# EAGLE design main (EAGLE 7.7.0)
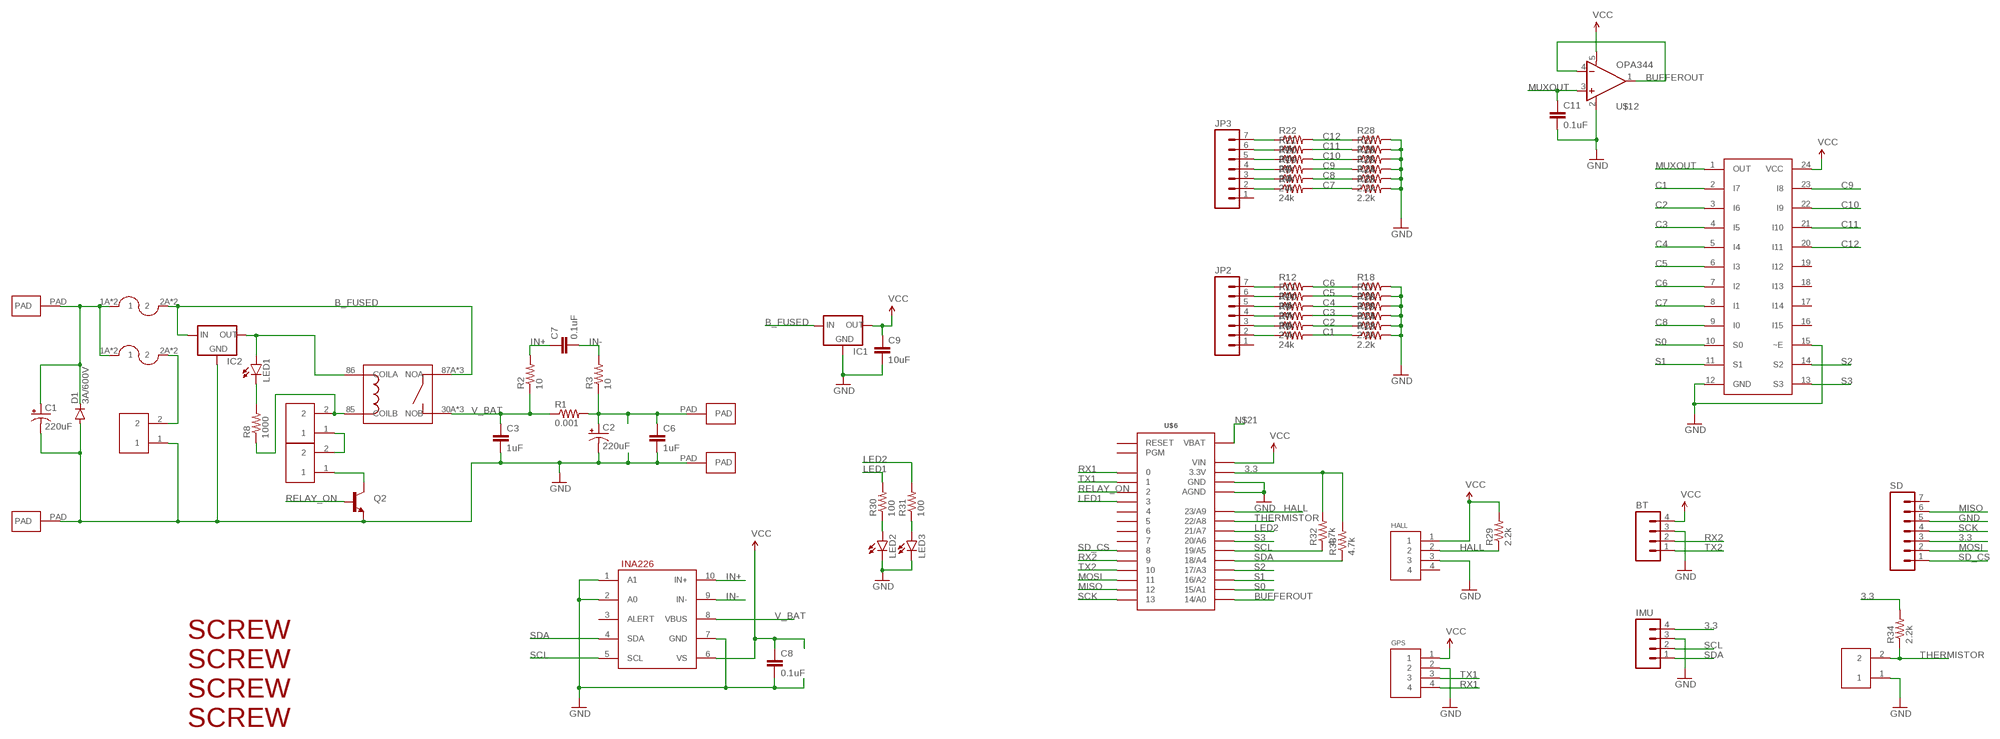
[diagram p0: schematic, sheet 1]

## Parts
BT  M04PTH  [1X04]
C1  220uF  CAP_POLPTH4  [CPOL-RADIAL-1000UF-25V]
C2  220uF  CAP_POLPTH4  [CPOL-RADIAL-1000UF-25V]
C3  1uF  CAP1206  [1206]
C6  1uF  CAP1206  [1206]
C7  0.1uF  CAP0603-CAP  [0603-CAP]
C8  0.1uF  CAP0603-CAP  [0603-CAP]
C9  10uF  CAP0805  [0805]
C11  0.1uF  CAP0603-CAP  [0603-CAP]
D1  3A/600V  DIODEES3J  [SMC]
GPS  GPS  HEADER4VALULOK  [4PINVALULOK]
HALL  HEADER4VALULOK  [4PINVALULOK]
IC1  V_REG_78XXSINK  [TO220-IGO]
IC2  V_REG_78XXSINK  [TO220-IGO]
IMU  M04PTH  [1X04]
JP2  M07  [1X07]
JP3  M07  [1X07]
LED1  LED1206  [LED-1206]
LED2  LED1206  [LED-1206]
LED3  LED1206  [LED-1206]
Q2  TRANSISTOR_NPNSMD2  [SOT223]
R1  0.001  RESISTOR2512  [R2512]
R2  10  RESISTOR0603-RES  [0603-RES]
R3  10  RESISTOR0603-RES  [0603-RES]
R4  24k  RESISTOR0603-RES  [0603-RES]
R5  24k  RESISTOR0603-RES  [0603-RES]
R6  24k  RESISTOR0603-RES  [0603-RES]
R7  24k  RESISTOR0603-RES  [0603-RES]
R8  1000  RESISTOR0603-RES  [0603-RES]
R9  24k  RESISTOR0603-RES  [0603-RES]
R10  24k  RESISTOR0603-RES  [0603-RES]
R11  24k  RESISTOR0603-RES  [0603-RES]
R12  24k  RESISTOR0603-RES  [0603-RES]
R13  2.2k  RESISTOR0603-RES  [0603-RES]
R14  2.2k  RESISTOR0603-RES  [0603-RES]
R15  2.2k  RESISTOR0603-RES  [0603-RES]
R16  2.2k  RESISTOR0603-RES  [0603-RES]
R17  2.2k  RESISTOR0603-RES  [0603-RES]
R18  2.2k  RESISTOR0603-RES  [0603-RES]
R19  24k  RESISTOR0603-RES  [0603-RES]
R20  24k  RESISTOR0603-RES  [0603-RES]
R21  24k  RESISTOR0603-RES  [0603-RES]
R22  24k  RESISTOR0603-RES  [0603-RES]
R23  2.2k  RESISTOR0603-RES  [0603-RES]
R24  2.2k  RESISTOR0603-RES  [0603-RES]
R25  2.2k  RESISTOR0603-RES  [0603-RES]
R26  2.2k  RESISTOR0603-RES  [0603-RES]
R27  2.2k  RESISTOR0603-RES  [0603-RES]
R28  2.2k  RESISTOR0603-RES  [0603-RES]
R29  2.2k  RESISTOR0603-RES  [0603-RES]
R30  100  RESISTOR0603-RES  [0603-RES]
R31  100  RESISTOR0603-RES  [0603-RES]
R32  4.7k  RESISTOR0603-RES  [0603-RES]
R33  4.7k  RESISTOR0603-RES  [0603-RES]
R34  2.2k  RESISTOR0603-RES  [0603-RES]
SD  M07  [1X07]
U$1  INA226  [PSOP-10]
U$2  PAD  [PAD]
U$3  PAD  [PAD]
U$4  PAD  [PAD]
U$5  PAD  [PAD]
U$6  TEENSY_3.0_BASIC  [TEENSY_3.0_BASIC]
U$7  RELAY  [PANASONIC_HP_RELAY]
U$8  FUSE  [AUTO_FUSE]
U$9  HEADER2  [2PINVALULOK]
U$10  HEADER2  [2PINVALULOK]
U$11  CD74HC4067  [SO-24DW]
U$12  OPA344  [SOT23-5]
U$13  SCREW  [M3HOLE]
U$14  SCREW  [M3HOLE]
U$15  SCREW  [M3HOLE]
U$16  SCREW  [M3HOLE]
U$17  HEADER2  [2PINVALULOK]
U$18  FUSE  [AUTO_FUSE]
U$19  HEADER2  [2PINVALULOK]

## Nets
3.3: IMU.4 R32.2 R33.2 R34.2 SD.3 U$6.3.3V U$6.3.3V1(3.3V)
B_FUSED: IC1.IN IC2.IN U$7.87A(NOA) U$7.87B(NOA) U$7.87C(NOA) U$8.2A U$8.2B
B_OUT: C2.+ C6.1 R1.2 R3.1 U$4.PAD
B_RAW: C1.+ D1.C U$2.PAD U$8.1A U$8.1B U$18.1A U$18.1B
BUFFEROUT: U$6.14/A0 U$12.1(OUT) U$12.4(-IN)
C1: R6.2 R13.1 U$11.2(I7)
C2: R7.2 R14.1 U$11.3(I6)
C3: R9.2 R15.1 U$11.4(I5)
C4: R10.2 R16.1 U$11.5(I4)
C5: R11.2 R17.1 U$11.6(I3)
C6: R12.2 R18.1 U$11.7(I2)
C7: R4.2 R23.1 U$11.8(I1)
C8: R5.2 R24.1 U$11.9(I0)
C9: R19.2 R25.1 U$11.23(I8)
C10: R20.2 R26.1 U$11.22(I9)
C11: R21.2 R27.1 U$11.21(I10)
C12: R22.2 R28.1 U$11.20(I11)
GND: BT.3 C1.- C2.- C3.2 C6.2 C8.2 C9.2 C11.2 D1.A GPS.2 HALL.3 IC1.GND IC2.GND IMU.3 LED2.C LED3.C Q2.3(E) R13.2 R14.2 R15.2 R16.2 R17.2 R18.2 R23.2 R24.2 R25.2 R26.2 R27.2 R28.2 SD.5 U$1.1(A1) U$1.2(A0) U$1.7(GND) U$3.PAD U$5.PAD U$6.AGND U$6.GND U$6.GND1(GND) U$11.12(GND) U$11.15(~E) U$12.2(V-) U$17.1 U$19.1
HALL: HALL.2 R29.1 U$6.23/A9
IN+: C7.1 R2.2 U$1.10(IN+)
IN-: C7.2 R3.2 U$1.9(IN-)
LED1: R30.2 U$6.3
LED2: R31.2 U$6.21/A7
MISO: SD.6 U$6.12
MOSI: SD.2 U$6.11
MUXOUT: C11.1 U$11.1(OUT) U$12.3(+IN)
N$1: JP2.7 R12.1
N$2: LED2.A R30.1
N$3: JP2.6 R11.1
N$4: JP2.5 R10.1
N$5: U$18.2A U$18.2B U$19.2
N$6: JP2.4 R9.1
N$7: IC2.OUT LED1.A U$7.86(COILA)
N$8: JP2.3 R7.1
N$9: LED1.C R8.2
N$10: R8.1 U$7.85(COILB) U$9.2
N$11: JP2.2 R6.1
N$12: U$9.1 U$10.2
N$13: Q2.2(C) U$10.1
N$14: JP3.7 R22.1
N$15: JP3.6 R21.1
N$16: JP3.5 R20.1
N$17: JP3.4 R19.1
N$18: JP3.3 R5.1
N$19: JP3.2 R4.1
N$20: LED3.A R31.1
N$21: U$6.VBAT
RELAY_ON: Q2.1(B) U$6.2
RX1: GPS.4 U$6.0
RX2: BT.2 U$6.9
S0: U$6.15/A1 U$11.10(S0)
S1: U$6.16/A2 U$11.11(S1)
S2: U$6.17/A3 U$11.14(S2)
S3: U$6.20/A6 U$11.13(S3)
SCK: SD.4 U$6.13
SCL: IMU.2 R32.1 U$1.5(SCL) U$6.19/A5
SD_CS: SD.1 U$6.8
SDA: IMU.1 R33.1 U$1.4(SDA) U$6.18/A4
THERMISTOR: R34.1 U$6.22/A8 U$17.2
TX1: GPS.3 U$6.1
TX2: BT.1 U$6.10
V_BAT: C3.1 R1.1 R2.1 U$1.8(VBUS) U$7.30A(NOB) U$7.30B(NOB) U$7.30C(NOB)
VCC: BT.4 C8.1 C9.1 GPS.1 HALL.1 IC1.OUT R29.2 U$1.6(VS) U$6.VIN U$11.24(VCC) U$12.5(V+)
Unconnected: HALL.4 JP2.1 JP3.1 SD.7 U$1.3(ALERT) U$6.4 U$6.5 U$6.6 U$6.7 U$6.PGM U$6.RESET U$11.16(I15) U$11.17(I14) U$11.18(I13) U$11.19(I12)

## Library data of the parts
BT IMU = SparkFun-Connectors:M04: Header 4 Standard 4-pin 0.1" header. Use with straight break away headers (SKU : PRT-00116), right angle break away headers (PRT-00553), swiss pins (PRT-00743), machine pins (PRT-00117), and female headers (PRT-00115). Molex polarized connector foot print use with SKU : PRT-08231 with associated crimp pins and housings. 1MM SMD Version SKU: PRT-10208
C1 C2 = SparkFun-Capacitors:CAP_POL: Capacitor Polarized These are standard SMD and PTH capacitors. Normally 10uF, 47uF, and 100uF in electrolytic and tantalum varieties. Always verify the external diameter of the through hole cap, it varies with capacity, voltage, and manufacturer. The EIA devices should be standard.
C3 C6 = SparkFun-Capacitors:CAP: Capacitor Standard 0603 ceramic capacitor, and 0.1" leaded capacitor.
C7-C9 C11 = SparkFun-Passives:CAP: Capacitor Standard 0603 ceramic capacitor, and 0.1" leaded capacitor.
D1 = SparkFun-DiscreteSemi:DIODE: Diode These are standard reverse protection diodes and small signal diodes. SMA package can handle up to about 1A. SOD-323 can handle about 200mA. What the SOD-323 package when ordering, there are some mfgs out there that are 5-pin packages.; PROD_ID: DIO-12441
GPS HALL = Custom_old:HEADER4
IC1 IC2 = SparkFun-PowerIC:V_REG_78XX: Voltage Regulator Standard 7805 5V regulator. IGO (Input Ground Output). Spark Fun Electronics SKU : COM-00107
JP2 JP3 SD = SparkFun-Connectors:M07: Header 7 Standard 7-pin 0.1" header. Use with straight break away headers (SKU : PRT-00116), right angle break away headers (PRT-00553), swiss pins (PRT-00743), machine pins (PRT-00117), and female headers (PRT-00115). NOTES ON THE VARIANTS LOCK and LOCK_LONGPADS... This footprint was designed to help hold the alignment of a through-hole component (i.e. 7-pin header) while soldering it into place. You may notice that each hole has been shifted either up or down by 0.005 of an inch from it's more standard position (which is usually a perfectly straight line). This slight alteration caused the pins (the squares in the middle) to touch the edges of the holes. Because they are alternating, it causes a "brace" to hold the header in place. 0.005 has proven to be the perfect amount of "off-center" position when using our standard breakaway headers. Although looks a little odd when you look at the bare footprint, once you have a header in there, the alteration is very hard to notice. Also, if you push a header all the way into place, it is covered up entirely on the bottom side. This idea of altering the position of holes to aid alignment will be further integrated into the Sparkfun Library for other footprints. It can help hold any component with 3 or more connection pins.
LED1-LED3 = SparkFun-LED:LED: LEDs Standard schematic elements and footprints for 5mm, 3mm, 1206, and 0603 sized LEDs. 5mm - Spark Fun Electronics SKU : COM-00529 (and others)
Q2 = SparkFun-DiscreteSemi:TRANSISTOR_NPN: Generic NPN BJT MMBT2222A - TRANS-08049 (SOT-23, 1A 40V) MPSA42 - TRANS-09116 (SOT-23, 500mA 300V) MMBT5088LT1G - TRANS-11160 (SOT-23, 50 mA 30V) BC547 - COM-08928 <http://www.sparkfun.com/products/8928> (TO-92 45V 100mA) (1.Collector 2.Base 3.Emitter) 2N3904 - COM-00521 <http://www.sparkfun.com/products/521> (TO-92 40V 200mA) (1.Emitter 2.Base 3.Collector) P2N2222A - COM-12852 <http://www.sparkfun.com/products/12852> (TO-92 40V 600mA) (1.Collector 2.Base 3.Emitter)
R1 = SparkFun-Resistors:RESISTOR: Resistor Basic schematic elements and footprints for 0603, 1206, and PTH resistors.
R2-R34 = SparkFun-Passives:RESISTOR: Resistor Basic schematic elements and footprints for 0603, 1206, and PTH resistors.
U$1 = Custom_old:INA226
U$2-U$5 = Custom_old:PAD
U$6 = Teensy3.0:TEENSY_3.0_BASIC: Basic Teensy 3.0 with none of the 'inner' pins enabled. See '+4', 'AllAnalogPins", and 'AllPins' packages for additional pin holes, as needed.
U$7 = Custom_old:RELAY
U$8 U$18 = Custom_old:FUSE
U$9 U$10 U$17 U$19 = Custom_old:HEADER2
U$11 = Custom_old:CD74HC4067
U$12 = SparkFun-AnalogIC:OPA344: Single gate rail-to-rail output op-amp. Inputs extend 300mV past rails.
U$13-U$16 = Custom_old:SCREW

## Board
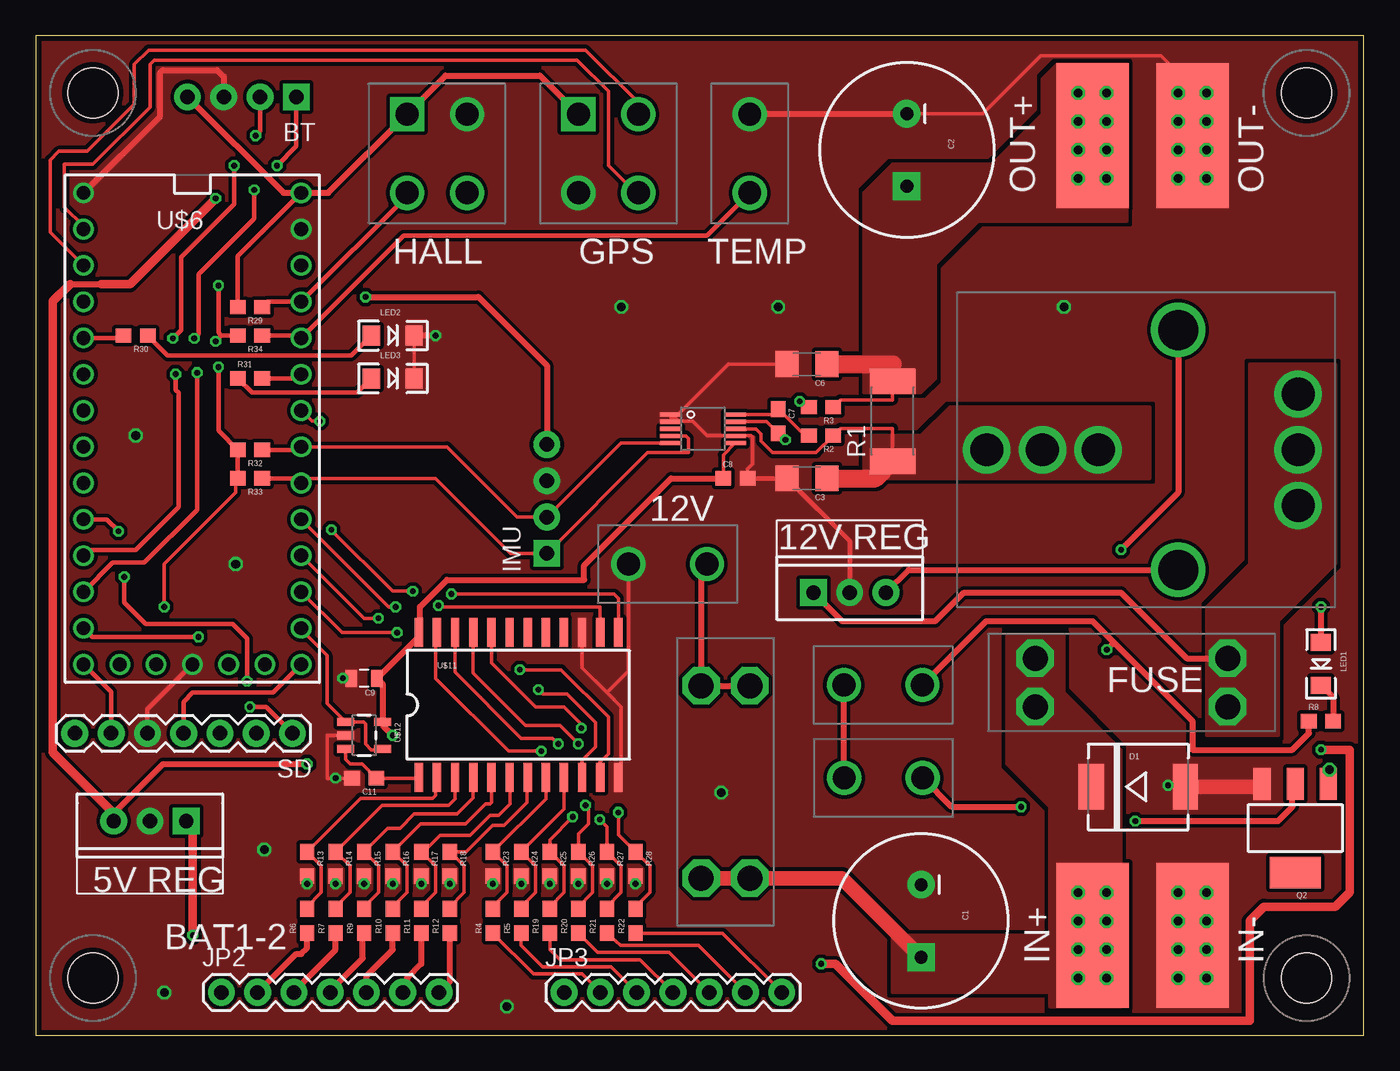
[diagram p1: board, top side]
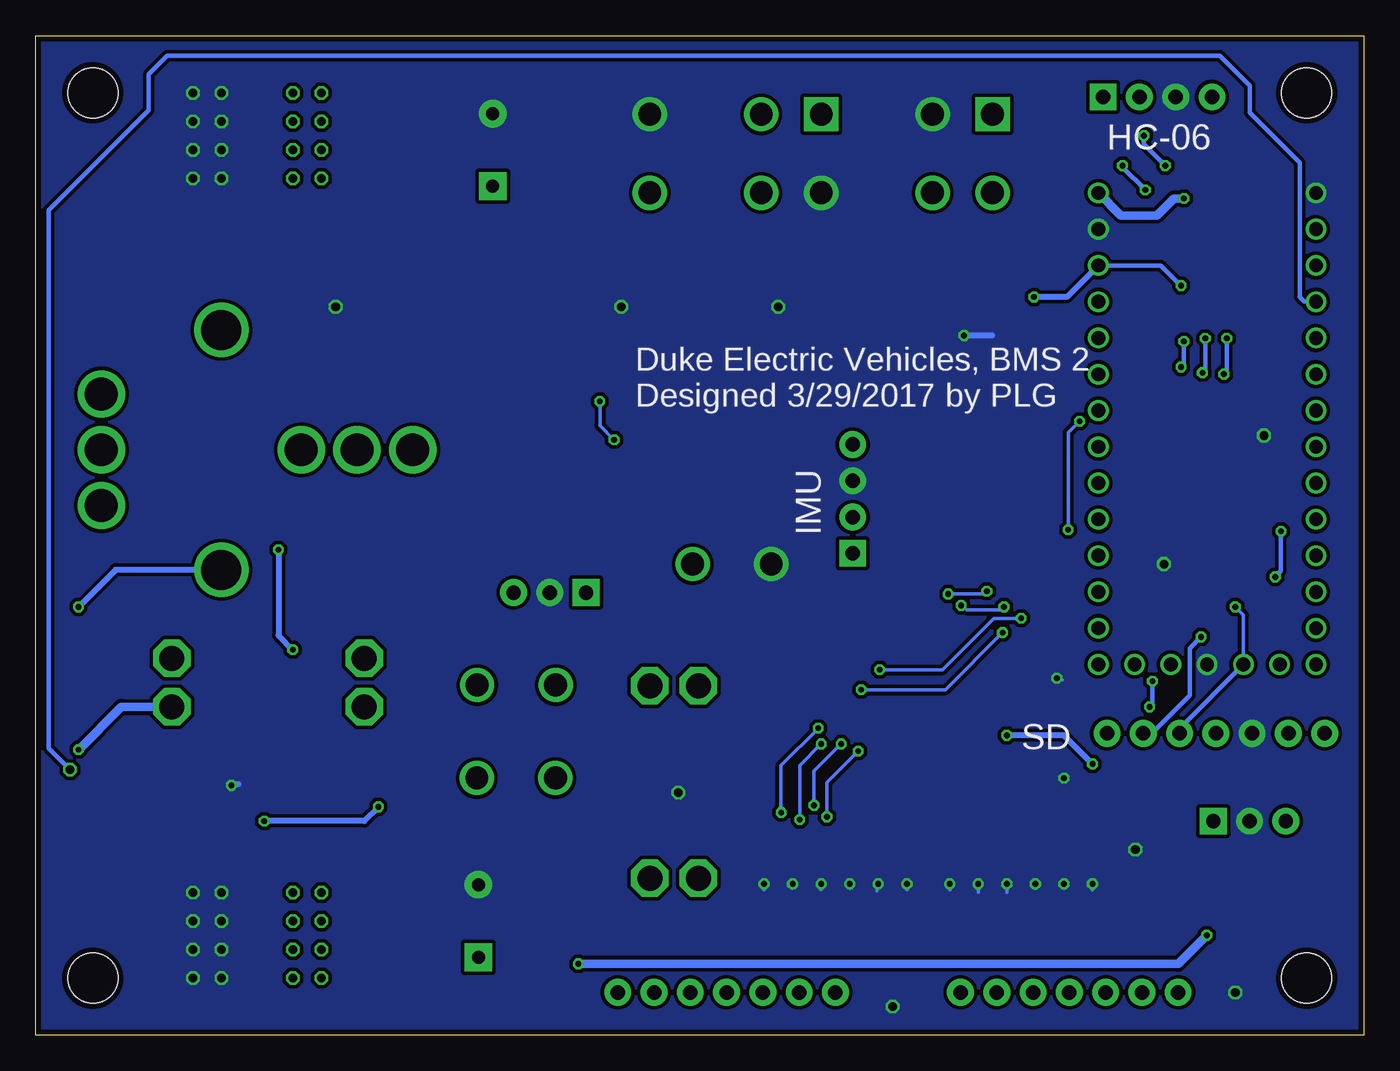
[diagram p2: board, bottom side, seen from below]

Size 93 x 70 mm. Coordinates in mm from the lower left corner, seen from the top.
Outline: 0,0 93,0 93,70 0,70 0,0
Copper layers (1*16): Top 0.0356mm / dielectric 1.5011mm / Bottom 0.0356mm
Design rules "PatrickOSHPARK *": minimum track width 6mil, minimum drill 13mil, track to track 6mil, track to pad 6mil, pad to pad 6mil, via to via 6mil, smd to smd 6mil, copper to edge 15mil, drill to drill 6mil, minimum pad ring 7mil, minimum via ring 7mil, stop-mask expansion 3mil, vias tented up to drill 20mil, thermal gap 10mil

### Footprints (pad centres in the part's own frame; a part is rotated, then mirrored left to right if it is on the bottom)
1X04 = drill 1.016 pad 1.88 square: 1 0,0 | drill 1.016 pad 1.88: 2 2.54,0; 3 5.08,0; 4 7.62,0
CPOL-RADIAL-1000UF-25V = drill 0.9 pad 1.93 square: + 2.54,0 | drill 0.9 pad 1.93: - -2.54,0
1206 = smd 1.6 x 1.8: 1 -1.4,0; 2 1.4,0
0603-CAP = smd 1.1 x 1: 1 -0.85,0; 2 0.85,0
0805 = smd 0.8 x 1.2: 1 -0.9,0; 2 0.9,0
SMC = smd 1.778 x 3.175: A 3.302,0; C -3.302,0
4PINVALULOK = drill 1.6 square: 1 0,5.5 | drill 1.6: 2 0,0; 3 4.2,5.5; 4 4.2,0
TO220-IGO = drill 1 pad 1.88: GND 0,0; OUT 2.54,0 | drill 1 pad 1.88 square: IN -2.54,0
1X07 = drill 1.016 pad 1.88: 1 0,0; 2 2.54,0; 3 5.08,0; 4 7.62,0; 5 10.16,0; 6 12.7,0; 7 15.24,0
LED-1206 = smd 1.2 x 1.4: A -1.5,0; C 1.5,0
SOT223 = smd 1.219 x 2.235: 1 -2.311,-3.099; 2 0,-3.099; 3 2.311,-3.099 | smd 3.6 x 2.2: 4 0,3.099
R2512 = smd 1.8 x 3.2: 1 -2.8,0; 2 2.8,0
0603-RES = smd 1.1 x 1: 1 -0.85,0; 2 0.85,0
PSOP-10 = smd 1.5 x 0.3: 1 0,1; 2 0,0.5; 3 0,0; 4 0,-0.5; 5 0,-1; 6 4.5,-1; 7 4.5,-0.5; 8 4.5,0; 9 4.5,0.5; 10 4.5,1
PAD = smd 10.16 x 5.08: PAD 0,0
TEENSY_3.0_BASIC = drill 0.965: 0 -7.62,13.97; 1 -7.62,11.43; 2 -7.62,8.89; 3 -7.62,6.35; 3.3V 7.62,11.43; 3.3V1 -2.54,-16.51; 4 -7.62,3.81; 5 -7.62,1.27; 6 -7.62,-1.27; 7 -7.62,-3.81; 8 -7.62,-6.35; 9 -7.62,-8.89; 10 -7.62,-11.43; 11 -7.62,-13.97; 12 -7.62,-16.51; 13 7.62,-16.51; 14/A0 7.62,-13.97; 15/A1 7.62,-11.43; 16/A2 7.62,-8.89; 17/A3 7.62,-6.35; 18/A4 7.62,-3.81; 19/A5 7.62,-1.27; 20/A6 7.62,1.27; 21/A7 7.62,3.81; 22/A8 7.62,6.35; 23/A9 7.62,8.89; AGND 7.62,13.97; GND -7.62,16.51; GND1 0,-16.51; PGM 2.54,-16.51; RESET 5.08,-16.51; VBAT -5.08,-16.51; VIN 7.62,16.51
PANASONIC_HP_RELAY = drill 2.3: 30A 5.6,0; 30B 9.5,0; 30C 13.4,0; 87A -8.4,3.9; 87B -8.4,0; 87C -8.4,-3.9 | drill 2.8: 85 0,-8.4; 86 0,8.4
AUTO_FUSE = drill 1.75 octagon: 1A 0,3.4; 1B 0,0; 2A 13.47,3.4; 2B 13.47,0
2PINVALULOK = drill 1.6: 1 0,5.5; 2 0,0
SO-24DW = smd 0.584 x 2.032: 1 -6.35,-5.08; 2 -5.08,-5.08; 3 -3.81,-5.08; 4 -2.54,-5.08; 5 -1.27,-5.08; 6 0,-5.08; 7 1.27,-5.08; 8 2.54,-5.08; 9 3.81,-5.08; 10 5.08,-5.08; 11 6.35,-5.08; 12 7.62,-5.08; 13 7.62,5.08; 14 6.35,5.08; 15 5.08,5.08; 16 3.81,5.08; 17 2.54,5.08; 18 1.27,5.08; 19 0,5.08; 20 -1.27,5.08; 21 -2.54,5.08; 22 -3.81,5.08; 23 -5.08,5.08; 24 -6.35,5.08
SOT23-5 = smd 0.55 x 1.2: 1 -0.95,-1.3; 2 0,-1.3; 3 0.95,-1.3; 4 0.95,1.3; 5 -0.95,1.3
M3HOLE = hole 3.5: 0,0

### Placement (x,y rotation side)
BT  18.25,65.71 180 top
C1  62,8 270 top
C2  61,62 270 top
C3  54,39 180 top
C6  54,47 180 top
C7  52,43 270 top
C8  49,39 0 top
C9  23,25 180 top
C11  23,18 180 top
D1  77.2,17.4 0 top
GPS  38,59 0 top
HALL  26,59 0 top
IC1  8,15 180 top
IC2  57,31 0 top
IMU  35.79,33.75 90 top
JP2  13,3 0 top
JP3  37,3 0 top
LED1  90,26 270 top
LED2  25,49 0 top
LED3  25,46 0 top
Q2  88.2,14.5 180 top
R1  60,43 90 top
R2  55,42 180 top
R3  55,44 180 top
R4  32,8 90 top
R5  34,8 90 top
R6  19,8 90 top
R7  21,8 90 top
R8  90,22 0 top
R9  23,8 90 top
R10  25,8 90 top
R11  27,8 90 top
R12  29,8 90 top
R13  19,12 270 top
R14  21,12 270 top
R15  23,12 270 top
R16  25,12 270 top
R17  27,12 270 top
R18  29,12 270 top
R19  36,8 90 top
R20  38,8 90 top
R21  40,8 90 top
R22  42,8 90 top
R23  32,12 270 top
R24  34,12 270 top
R25  36,12 270 top
R26  38,12 270 top
R27  40,12 270 top
R28  42,12 270 top
R29  15,51 180 top
R30  7,49 180 top
R31  15,46 0 top
R32  15,41 180 top
R33  15,39 180 top
R34  15,49 180 top
SD  17.98,21.14 180 top
U$1  44.47,42.47 0 top
U$2  74,7 90 top
U$3  81,63 90 top
U$4  74,63 90 top
U$5  81,7 90 top
U$6  10.97,42.48 0 top
U$7  80,41 180 top
U$8  70,23 0 top
U$9  62.09,24.53 90 top
U$10  56.61,18.02 270 top
U$11  33.18,23.13 0 top
U$12  23,21 270 top
U$13  89,4 0 top
U$14  89,66 0 top
U$15  4,66 0 top
U$16  4,4 0 top
U$17  50,59 0 top
U$18  50,11 90 top
U$19  47,33 90 top

### Tracks (layer width: path | path; a pad name or v marks a point on that pad's centre or on a via)
3.3  (via drill 0.4)
  Top 0.254: v9,30 9,33 14,38 14,38.85 R33.2
  Top 0.305: v12.8,52.5 12.8,49.2 13,49 | 13,49 R34.2 | R33.2 R32.2 12.8,42.35 v12.8,46.8 | v12.6,48.6 13,49
  Top 0.406: v23.1,51.7 31,51.7 35.79,46.91 IMU.4
  Bottom 0.254: U$6.3.3V1 8.43,29.43 v9,30
  Bottom 0.305: U$6.3.3V 14.21,53.91 v12.8,52.5 | v12.8,46.8 12.6,47 v12.6,48.6 | SD.3 12.9,21.5 U$6.3.3V1
  Bottom 0.406: U$6.3.3V 20.8,51.7 v23.1,51.7
B_FUSED  (via drill 0.4)
  Top 0.406: IC2.IN 56.46,29 63,29 65,31 76,31 80.6,26.4 U$8.2A
  Top 0.61: IC1.IN 11,14.54 v11,7 | v90,20 92,20 92,10 91,9 86,9 85,8 85,1 60,1 56,5 v55,5
  Bottom 0.61: v90,20 87,23 U$8.2B | v11,7 13,5 v55,5
  pour Top (isolate 0.254, no thermals): 82,29 82,21 87,21 87,29 91,33 91,47 85,47 85,33 82,30
B_OUT  (via drill 0.6)
  Top 0.254: R3.1 56.35,44.5 60,44.5 R1.2 60,47
  Top 1.27: C6.1 60,47
  other vias: 73,60 75,60 75,62 73,62 75,64 73,64 73,66 75,66
  pour Top (isolate 0.254, no thermals): 58,45 62,45 63,46 63,54 66,57 76,57 76.4,57 76.4,68 71.5,68 70.5,67 70.5,64.5 67,61 60,61 58,59
B_RAW  (via drill 0.6)
  Top 1.016: U$18.1A U$18.1B 56.46,11 C1.+
  other vias: 73,10 75,10 73,4 75,4 75,6 73,6 73,8 75,8
  pour Top (isolate 0.254, no thermals): 76,2 76,20 72,24 72,28 68,28 68,19 71,16 71,2
  pour Top (isolate 0.254, no thermals): 60,7 60,3 76,3 76,8 75,7
BUFFEROUT
  Top 0.254: U$12.4 24.25,20 23.5,20 23.1,20.4 23.1,21.8 22.95,21.95 U$12.1 20.4,23.25 20.4,26.6 18.59,28.41 U$6.14/A0
C1
  Top 0.254: R6.2 19,9 20,10 20,11.85 R13.1 22.75,16.6 27.8,16.6 28,16.8 28,17.95 U$11.2
C2
  Top 0.254: R7.2 21,9 22,10 22,11.85 R14.1 24.25,16.1 28.9,16.1 29.37,16.57 U$11.3
C3
  Top 0.254: R9.2 23,9 24,10 24,11.85 R15.1 24.65,14.5 25.5,14.5 26.5,15.5 29.5,15.5 30.64,16.64 U$11.4
C4
  Top 0.254: R10.2 25,9 26,10 26,11.85 R16.1 26.95,14.8 30.1,14.8 31.5,16.2 31.8,16.2 31.91,16.31 U$11.5
C5
  Top 0.254: R11.2 27,9 28,10 28,11.85 R17.1 27.15,12.85 28.3,14 30.4,14 31.8,15.4 32.4,15.4 33.2,16.2 33.2,18.03 U$11.6
C6
  Top 0.254: R12.2 29,9 30,10 30,11.85 R18.1 30.15,12.85 32,14.7 32.8,14.7 34.4,16.3 34.4,18 U$11.7
C7
  Top 0.254: R4.2 32,9 33,10 33,11.85 R23.1 35.72,16.57 U$11.8
C8
  Top 0.254: R5.2 34,9 35,10 35,11.85 R24.1 36.99,15.84 U$11.9
C9  (via drill 0.4)
  Top 0.254: R19.2 36,9 37,10 37,11.85 R25.1 36,13.7 v37.6,15.3 | v35.4,19.9 33.1,19.9 28,25 28,28.11 U$11.23
  Bottom 0.254: v37.6,15.3 37.6,17.7 v35.4,19.9
C10  (via drill 0.4)
  Top 0.254: R20.2 38,9 39,10 39,11.85 R26.1 38,14.1 38.7,14.8 38.7,15.9 v38.5,16.1 | v36.6,20.4 36.2,20.8 34,20.8 29.37,25.43 U$11.22
  Bottom 0.254: v38.5,16.1 38.5,18.5 v36.6,20.4
C11  (via drill 0.4)
  Top 0.254: R21.2 40,9 41,10 41,11.85 R27.1 40,14.6 v39.5,15.1 | U$11.21 30.64,25.36 34.3,21.7 36.7,21.7 v38,20.4
  Bottom 0.254: v38,20.4 39.5,18.9 v39.5,15.1
C12  (via drill 0.4)
  Top 0.254: R22.2 42,9 43,10 43,11.85 R28.1 40.8,14.05 v40.8,15.6 | v38.2,21.5 38.2,21.8 37,23 35,23 31.91,26.09 U$11.20
  Bottom 0.254: v40.8,15.6 40.8,18.9 v38.2,21.5
GND  (via drill 0.4, 0.6)
  Top 0.254: C6.2 48.5,47 U$1.2 U$1.1 44.53,43.47 45,43 46,43 47,42 48.94,42 U$1.7 49,42 50.1,42 50.2,41.9 50.2,40 49.85,39.65 C8.2 | U$11.15 38.26,25.74 40,24 | 40,24 41,23 41,18.25 U$11.12 | U$19.1 41.5,25.5 40,24 | R13.2 v19,10.6 | R14.2 v21,10.6 | R15.2 v23,10.6 | R16.2 v25,10.6 | R17.2 v27,10.6 | R18.2 v29,10.6 | R23.2 v32,10.6 | R24.2 v34,10.6 | R25.2 v36,10.6 | R26.2 v38,10.6 | R27.2 v40,10.6 | R28.2 v42,10.6 | U$12.2 20.4,21 20.4,18 v21,18 C11.2 | C9.2 v21.5,25 | C2.- 66.34,64.54 70.4,68.6 78.8,68.6 81.4,66 81.4,63.4 U$3.PAD | LED2.C LED3.C | v80,6 80.5,6.5 80.5,7
  Top 0.305: SD.5 7.82,22.82 U$6.GND1 | IC2.GND 57,34.6 C3.2 C8.2
  Top 0.406: U$17.1 50.04,64.54 C2.- | U$6.GND 8.7,64.34 8.7,67.4 8.9,67.6 12.7,67.6 13.17,67.13 BT.3 | v28,49 LED2.C | D1.A 80.4,17.5 v79.3,17.5
  Top 1.016: U$5.PAD 80.5,7 | D1.A 85.99,17.4 Q2.3
  Bottom 0.254: v19,10.6 19,10.2 | v21,10.6 21,10.3 | v23,10.6 23,10.3 | v25,10.6 25,10 | v27,10.6 27,10 | v29,10.6 29,10.2 | v32,10.6 32,10.2 | v34,10.6 34.1,10.6 34.1,10.1 | v36,10.6 36,10.3 | v38,10.6 38,10.2 | v40,10.6 40,10.3 | v42,10.6 42,10.2 | v21.5,25 21.5,24.9 21.1,24.9
  Bottom 0.406: 26.04,49 v28,49 | v79.3,17.5 79.2,17.6 78.8,17.6
  other vias: 80,10 80,8 80,4 82,4 82,6 82,8 82,10 41,51 52,51 72,51 14,33 16,13 9,3 33,2 48,17 7,42 80,60 82,60 80,62 82,62 82,64 80,64 80,66 82,66
  pour Bottom (isolate 0.254, no thermals): -2,71 -2,-2 95,-2 95,71
  pour Top (isolate 0.254, rank 6, no thermals): 0,70 0,0 93,0 93,70
HALL
  Top 0.305: HALL.2 26,58.78 U$6.23/A9 16.22,51.37 R29.1
IN+
  Top 0.254: U$1.10 51.62,43.47 C7.1 53.85,42 R2.2
IN-  (via drill 0.4)
  Top 0.254: U$1.9 51.18,42.97 C7.2 52.45,41.7 v52.5,41.7 | R3.2 53.9,44 v53.5,44.4
  Bottom 0.254: v53.5,44.4 53.5,42.7 v52.5,41.7
LED1
  Top 0.305: U$6.3 5.98,48.83 R30.2
LED2
  Top 0.305: U$6.21/A7 18.3,46 R31.2
MISO
  Top 0.305: SD.6 5.28,24.04 U$6.12
MOSI  (via drill 0.4)
  Top 0.305: U$6.11 3.96,27.9 v11.4,27.9
  Bottom 0.305: SD.2 14.86,21.14 12.2,23.8 12.2,27.1 v11.4,27.9
MUXOUT
  Top 0.254: U$11.1 26.78,18 C11.1 22.85,19 22,19 21.7,19.3 U$12.3
N$1
  Top 0.406: JP2.7 29,3.76 R12.1
N$2
  Top 0.305: R30.1 9.25,47.6 22.1,47.6 LED2.A
N$3
  Top 0.406: R11.1 27,5 26,4 26,3.3 JP2.6
N$4
  Top 0.406: JP2.5 23.16,4.16 25,6 R10.1
N$5
  Top 0.406: U$18.2B U$18.2A 46.6,32.6 U$19.2
N$6
  Top 0.406: JP2.4 20.62,3.12 22.9,5.4 22.9,7.05 R9.1
N$7  (via drill 0.4)
  Top 0.406: v90,30 LED1.A | IC2.OUT 61.14,32.6 U$7.86
  Bottom 0.406: U$7.86 87.4,32.6 v90,30
N$8
  Top 0.406: JP2.3 18.08,3.08 21,6 R7.1
N$9
  Top 0.406: LED1.C 90.85,23.65 R8.2
N$10  (via drill 0.4)
  Top 0.406: U$9.2 66.56,29 74,29 75.5,27.5 | 75.5,27.5 81,22 81,20 88,20 89.15,21.15 R8.1 | U$7.85 80,38 v76,34 | v75,27 75.5,27.5
  Bottom 0.406: v76,34 76,28 v75,27
N$11
  Top 0.406: JP2.2 18.24,5.7 18.6,5.7 19,6.1 R6.1
N$12
  Top 0.406: U$10.2 56.59,18.04 U$9.1
N$13  (via drill 0.4)
  Top 0.406: U$10.1 64.13,16 v69,16 | Q2.2 88,17.4 88,16 87,15 v77,15
  Bottom 0.406: v69,16 70,15 v77,15
N$14
  Top 0.254: JP3.7 48.09,7.15 R22.1
N$15
  Top 0.254: R21.1 40.95,6.3 46.4,6.3 JP3.6
N$16
  Top 0.254: R20.1 39.35,5.8 44.36,5.8 JP3.5
N$17
  Top 0.254: R19.1 36,6 36.7,5.3 42.32,5.3 JP3.4
N$18
  Top 0.254: R5.1 34,6.3 35.5,4.8 40.28,4.8 JP3.3
N$19
  Top 0.254: R4.1 34.85,4.3 38.24,4.3 JP3.2
N$20
  Top 0.305: LED3.A 22.5,45 15.15,45 R31.1
RELAY_ON  (via drill 0.6)
  Top 0.305: Q2.1 90.6,17.69 v90.6,18.6
  Bottom 0.305: v90.6,18.6 92.1,20.1 92.1,57.8 85.1,64.8 85.1,67.3 83.8,68.6 10.1,68.6 8,66.5 8,64.6 4.5,61.1 4.5,51.7 4.17,51.37 U$6.2
RX1
  Top 0.254: U$6.0 3.35,56.65 2,58 2,61 4,61 8,65 8,68 8.3,68.3 37.9,68.3 40.1,66.1 40.1,60.9 42,59 GPS.4
RX2  (via drill 0.4)
  Top 0.305: U$6.9 3.76,34 7,34 10,37 10,45 9.8,45.2 v9.8,46.3 | v9.6,48.8 10.2,49.4 10.2,54.5 13.9,58.2 v13.9,60.9 | v15.4,63 15.71,63.31 BT.2
  Bottom 0.305: v9.8,46.3 9.6,46.5 v9.6,48.8 | v13.9,60.9 15.4,62.4 v15.4,63
S0  (via drill 0.4)
  Top 0.254: U$11.10 38.26,19.26 39.2,20.2 39.2,21.9 37.2,23.9 35.5,23.9 v35.2,24.2 | v25.3,28.2 21.44,28.2 U$6.15/A1
  Bottom 0.254: v35.2,24.2 29.3,24.2 v25.3,28.2
S1  (via drill 0.4)
  Top 0.254: U$11.11 39.53,19.13 40.1,19.7 40.1,22.3 36.8,25.6 v33.9,25.6 | v24,29.2 22.98,29.2 U$6.16/A2
  Bottom 0.254: v33.9,25.6 29.5,25.6 25.9,29.2 v24,29.2
S2  (via drill 0.4)
  Top 0.254: U$6.17/A3 24.72,30 v25.2,30 | U$11.14 39.53,30 28.2,30 v28.2,30.1
  Bottom 0.254: v28.2,30.1 27.8,29.8 25.5,29.8 25.3,30 v25.2,30
S3  (via drill 0.4)
  Top 0.254: U$11.13 40.8,30.6 40.5,30.9 v29.1,30.9 | v19.9,43 19.34,43 U$6.20/A6 | v20.7,35.4 25,31.1 v26.4,31.1
  Bottom 0.254: v20.7,35.4 20.7,42.2 v19.9,43 | v26.4,31.1 26.6,30.9 v29.1,30.9
SCK
  Top 0.305: SD.4 10.36,23.36 11,24 16.62,24 U$6.13
SCL
  Top 0.254: U$6.19/A5 28.79,41.21 33.71,36.29 IMU.2 40.97,41.47 U$1.5
  Top 0.305: R32.1 18.38,41 U$6.19/A5
SD_CS  (via drill 0.4)
  Top 0.305: SD.1 16.12,23 v15,23 | v14.8,24.8 14.8,27.8 13.8,28.8 7.7,28.8 6.2,30.3 v6.2,32.1 | v5.8,35.3 4.97,36.13 U$6.8
  Bottom 0.305: v15,23 14.8,23.2 v14.8,24.8 | v6.2,32.1 5.8,32.5 v5.8,35.3
SDA
  Top 0.254: U$6.18/A4 18.92,39 28,39 33.25,33.75 IMU.1 42.84,40.8 45.7,40.8 45.7,41.8 45.53,41.97 U$1.4
  Top 0.305: R33.1 18.26,39 U$6.18/A4
THERMISTOR
  Top 0.305: U$17.2 47,56 25.76,56 U$6.22/A8 18.42,49 R34.1
TX1
  Top 0.254: GPS.3 42.2,65.3 38.5,69 7.9,69 6.9,68 6.9,65.2 3.6,61.9 1.6,61.9 1,61.3 1,56.26 U$6.1
TX2  (via drill 0.4)
  Top 0.305: U$6.10 5.4,33.1 7.6,33.1 11.3,36.8 v11.3,46.4 | v11.1,48.8 11.4,49.1 11.4,53.3 15.3,57.2 v15.3,59.2 | v16.9,60.9 18.25,62.25 BT.1
  Bottom 0.305: v11.3,46.4 11.1,46.6 v11.1,48.8 | v15.3,59.2 16.9,60.8 v16.9,60.9
V_BAT
  Top 0.254: R1.1 60,42.5 56.35,42.5 R2.1 54.65,40.8 51.6,40.8 50.8,41.6 50.8,42.1 50.43,42.47 U$1.8
  Top 1.27: C3.1 58.8,39 R1.1
  pour Top (isolate 0.254, no thermals): 58,42 58,39 78,39 78,44 64,44 62,42
VCC  (via drill 0.4)
  Top 0.254: U$1.6 48.15,40.65 C8.1
  Top 0.305: R29.2 14.15,54.55 U$6.VIN
  Top 0.406: GPS.1 35.3,67.2 28.7,67.2 HALL.1 20.49,58.99 U$6.VIN 17.35,58.99 BT.4 | 2.4,52.6 4.6,52.6 | 5.46,15.54 8.92,19 v19,19 | v25,21 24.3,21.7 U$12.5 24.3,24.6 C9.1 26.83,27.93 U$11.24 26.9,28.28 26.9,30 28.8,31.9 38.4,31.9 38.4,32.9 44.5,39 C8.1
  Top 0.61: IC1.OUT 5.46,15.54 1.2,19.8 1.2,51.4 2.4,52.6 | 4.6,52.6 6.6,52.6 v12.6,58.6
  Bottom 0.406: v19,19 21,21 v25,21
  Bottom 0.61: v12.6,58.6 13.3,58.6 14.5,57.4 17,57.4 U$6.VIN

### Text on the board
tPlace: OUT+ | OUT- | HALL | GPS | TEMP | 12V | 12V REG | FUSE | 5V REG | BAT1-2 | IN+ | IN-
bPlace: HC-06 | Duke Electric Vehicles, BMS 2 / Designed 3/29/2017 by PLG | IMU | SD